# Altium schematic sheet power_module.SchDoc
size A
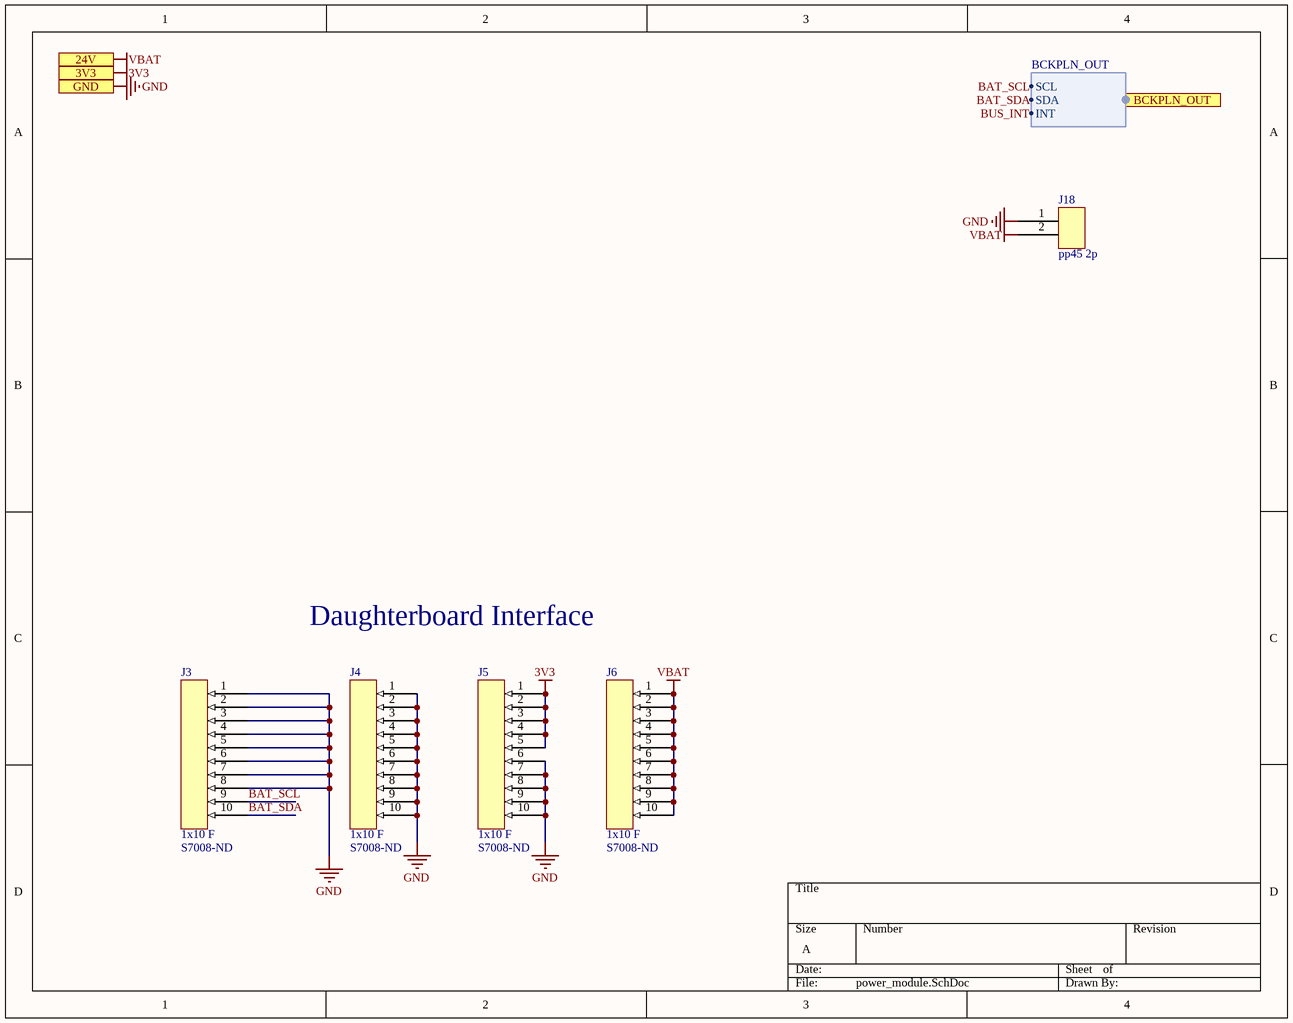
[diagram p0: power_module.SchDoc]

## Parts
J3  1x10 F  Supplier Part Number 1: S7008-ND  [CONN HDR 1x10 F]
J4  1x10 F  Supplier Part Number 1: S7008-ND  [CONN HDR 1x10 F]
J5  1x10 F  Supplier Part Number 1: S7008-ND  [CONN HDR 1x10 F]
J6  1x10 F  Supplier Part Number 1: S7008-ND  [CONN HDR 1x10 F]
J18  pp45 2p  [CONN PP45 2P VERT]

## Ports
3V3, 24V, BCKPLN_OUT (harness BCKPLN_OUT), GND

## Harnesses
BCKPLN_OUT: SCL, SDA, INT

## Nets
3V3: J5.1 J5.2 J5.3 J5.4 J5.5 ; port 3V3
GND: J3.1 J3.2 J3.3 J3.4 J3.5 J3.6 J3.7 J3.8 J4.1 J4.2 J4.3 J4.4 J4.5 J4.6 J4.7 J4.8 J4.9 J4.10 J5.6 J5.7 J5.8 J5.9 J5.10 J18.1 ; port GND
VBAT: J6.1 J6.2 J6.3 J6.4 J6.5 J6.6 J6.7 J6.8 J6.9 J6.10 J18.2 ; port 24V
BAT_SCL: J3.9 ; port BCKPLN_OUT.SCL
BAT_SDA: J3.10 ; port BCKPLN_OUT.SDA
BUS_INT: port BCKPLN_OUT.INT

## Notes on the sheet
- Daughterboard Interface

## Library data of the parts
J3-J6 = CONN header 1x10 F: Supplier 1: Digi-Key
J18 = CONN pp45 1x2 vert: Heavy Duty Power Connectors PCB45 VERT.MT.SHORT TAIL LP CONT; Manufacturer 1: Anderson Power; Manufacturer Part Number 1: 3-5911P1; Supplier 1: Digi-Key; RoHS: Yes; Category: Connectors; Stock 1: 4595; Pricing 1: 1=0.70000, 10=0.66000, 25=0.59400, 50=0.52800, 100=0.50600, 250=0.46200, 500=0.44000, 1000=0.36300, 2500=0.33000 (USD); ComponentLink1URL: http://www.andersonpower.com/files.php?file=DS-PP1545(2).pdf&src-supplier=Mouser; ComponentLink1Description: http://www.andersonpower.com/files.php?file=DS-PP1545(2).pdf&src-supplier=Mouser; Supplier Part Number 1: 2243-3-5911P1-ND